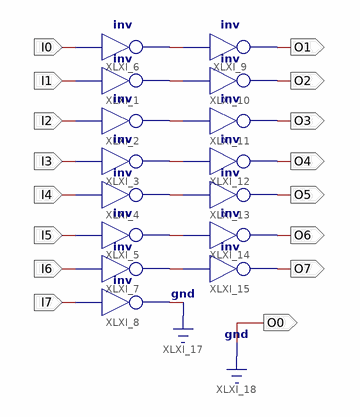
[diagram p0: schematic sheet 1]
// Xilinx ISE schematic SHL.sch (spartan6) as structural Verilog: 15 symbols, 16 ports
module SHL (
  input  I0,
  input  I1,
  input  I2,
  input  I3,
  input  I4,
  input  I5,
  input  I6,
  input  I7,
  output O1,
  output O2,
  output O3,
  output O4,
  output O5,
  output O6,
  output O7,
  output O0
);

  wire XLXN_2, XLXN_3, XLXN_4, XLXN_5, XLXN_6, XLXN_7, XLXN_8;

  not XLXI_1 (XLXN_3, I1);
  not XLXI_2 (XLXN_4, I2);
  not XLXI_3 (XLXN_5, I3);
  not XLXI_4 (XLXN_6, I4);
  not XLXI_5 (XLXN_7, I5);
  not XLXI_6 (XLXN_2, I0);
  not XLXI_7 (XLXN_8, I6);
  // inv XLXI_8 has open pins: I=I7, O=1'b0
  not XLXI_9 (O1, XLXN_2);
  not XLXI_10 (O2, XLXN_3);
  not XLXI_11 (O3, XLXN_4);
  not XLXI_12 (O4, XLXN_5);
  not XLXI_13 (O5, XLXN_6);
  not XLXI_14 (O6, XLXN_7);
  not XLXI_15 (O7, XLXN_8);

  assign O0 = 1'b0;
endmodule
